# EAGLE design DAT Replacement (EAGLE 6.5.0)
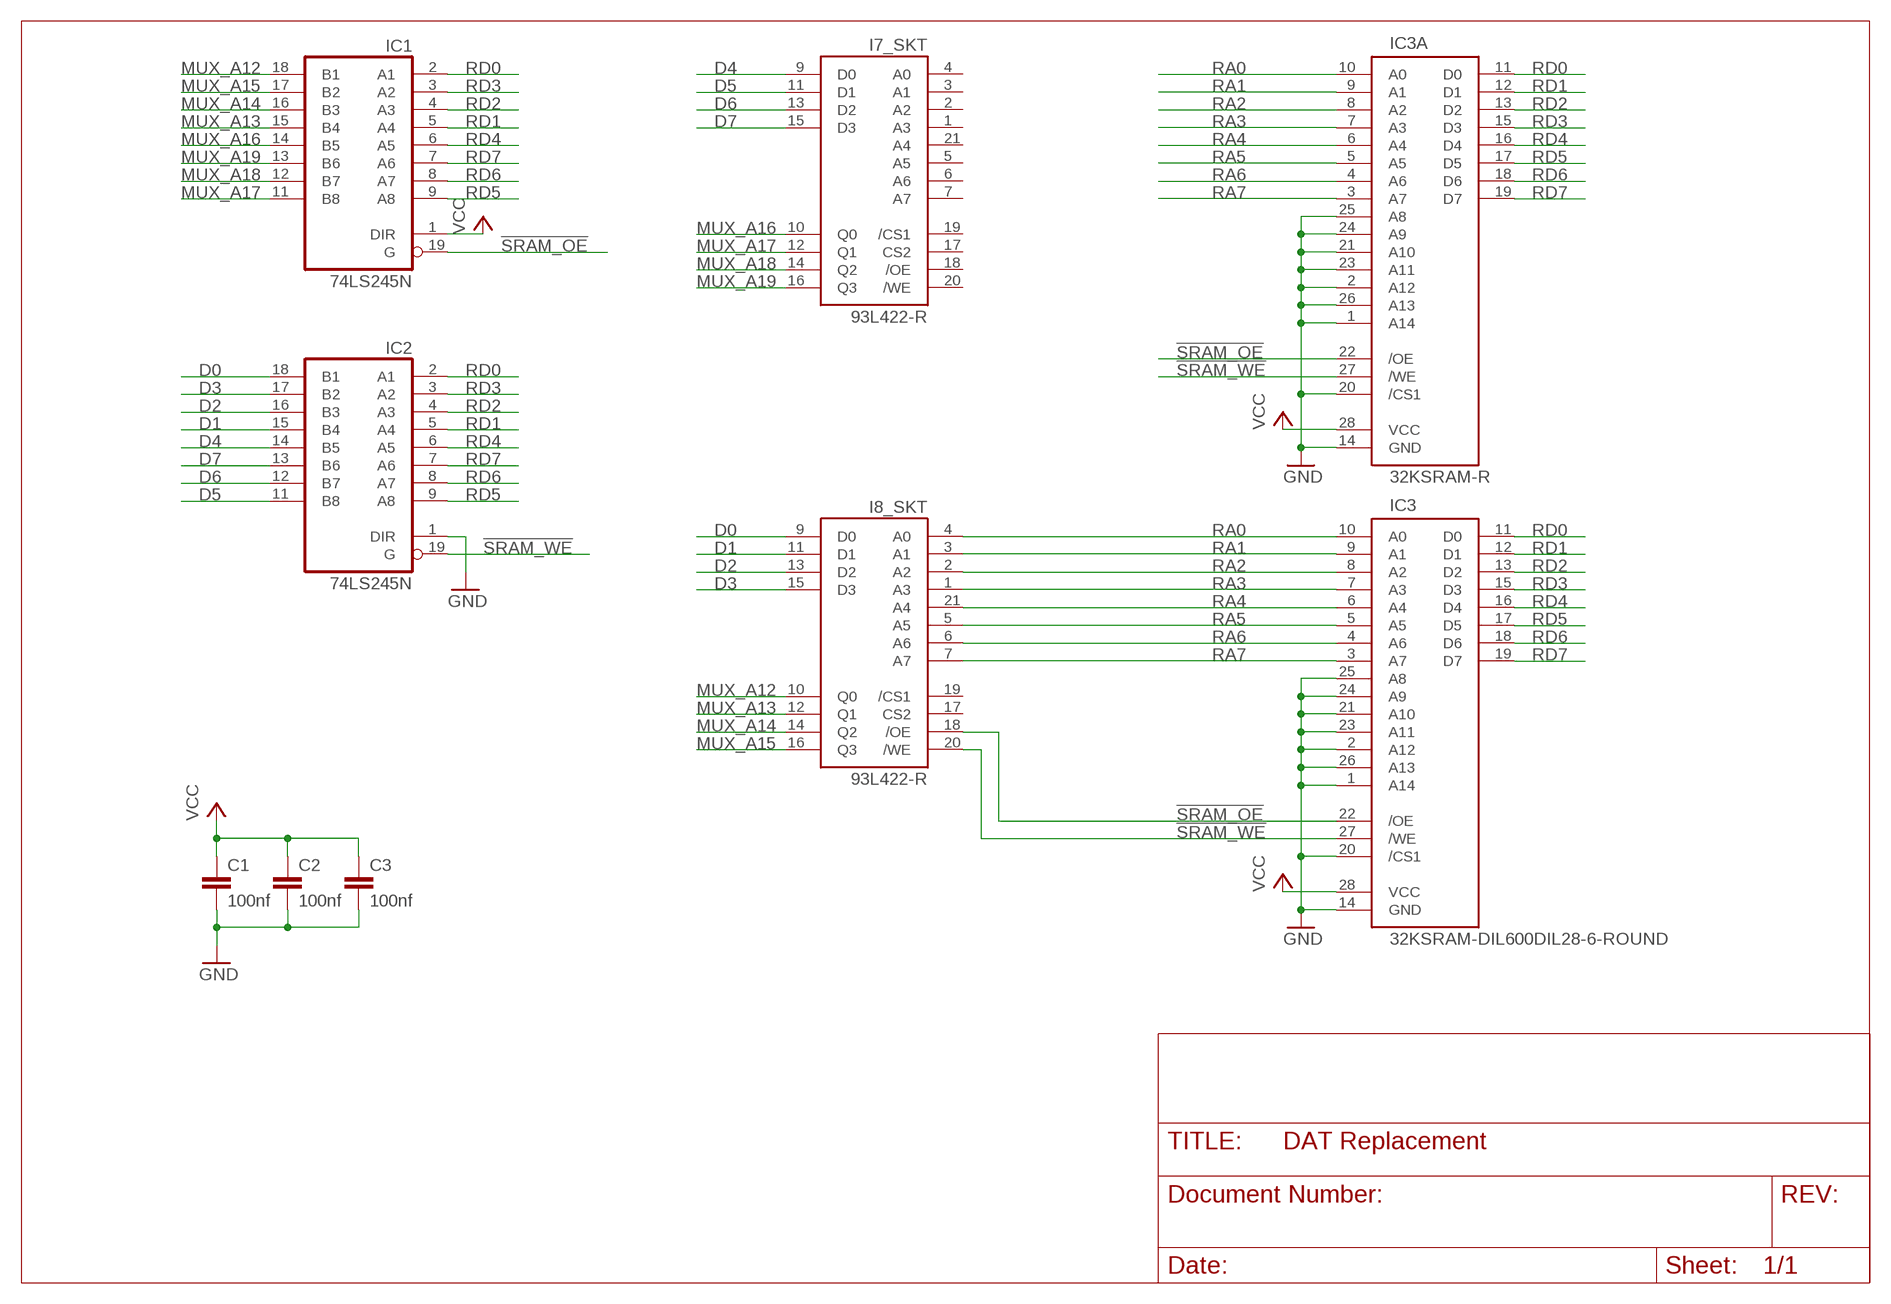
[diagram p0: schematic, sheet 1]

## Parts
C1  100nf  C-EU025-025X050  [C025-025X050]
C2  100nf  C-EU025-025X050  [C025-025X050]
C3  100nf  C-EU025-025X050  [C025-025X050]
I7_SKT  93L422-R  [DIL-22-4-ROUND]
I8_SKT  93L422-R  [DIL-22-4-ROUND]
IC1  74LS245N  [DIL20]
IC2  74LS245N  [DIL20]
IC3  32KSRAM-DIL600DIL28-6-ROUND  [DIL28-6-ROUND]
IC3A  32KSRAM-R  [DIL28-3-ROUND]

## Nets
!SRAM_OE: I8_SKT.18(/OE) IC1.19(G) IC3.22(/OE) IC3A.22(/OE)
!SRAM_WE: I8_SKT.20(/WE) IC2.19(G) IC3.27(/WE) IC3A.27(/WE)
D0: I8_SKT.9(D0) IC2.18(B1)
D1: I8_SKT.11(D1) IC2.15(B4)
D2: I8_SKT.13(D2) IC2.16(B3)
D3: I8_SKT.15(D3) IC2.17(B2)
D4: I7_SKT.9(D0) IC2.14(B5)
D5: I7_SKT.11(D1) IC2.11(B8)
D6: I7_SKT.13(D2) IC2.12(B7)
D7: I7_SKT.15(D3) IC2.13(B6)
GND: C1.2 C2.2 C3.2 IC2.1(DIR) IC3.1(A14) IC3.2(A12) IC3.14(GND) IC3.20(/CS1) IC3.21(A10) IC3.23(A11) IC3.24(A9) IC3.25(A8) IC3.26(A13) IC3A.1(A14) IC3A.2(A12) IC3A.14(GND) IC3A.20(/CS1) IC3A.21(A10) IC3A.23(A11) IC3A.24(A9) IC3A.25(A8) IC3A.26(A13)
MUX_A12: I8_SKT.10(Q0) IC1.18(B1)
MUX_A13: I8_SKT.12(Q1) IC1.15(B4)
MUX_A14: I8_SKT.14(Q2) IC1.16(B3)
MUX_A15: I8_SKT.16(Q3) IC1.17(B2)
MUX_A16: I7_SKT.10(Q0) IC1.14(B5)
MUX_A17: I7_SKT.12(Q1) IC1.11(B8)
MUX_A18: I7_SKT.14(Q2) IC1.12(B7)
MUX_A19: I7_SKT.16(Q3) IC1.13(B6)
RA0: I8_SKT.4(A0) IC3.10(A0) IC3A.10(A0)
RA1: I8_SKT.3(A1) IC3.9(A1) IC3A.9(A1)
RA2: I8_SKT.2(A2) IC3.8(A2) IC3A.8(A2)
RA3: I8_SKT.1(A3) IC3.7(A3) IC3A.7(A3)
RA4: I8_SKT.21(A4) IC3.6(A4) IC3A.6(A4)
RA5: I8_SKT.5(A5) IC3.5(A5) IC3A.5(A5)
RA6: I8_SKT.6(A6) IC3.4(A6) IC3A.4(A6)
RA7: I8_SKT.7(A7) IC3.3(A7) IC3A.3(A7)
RD0: IC1.2(A1) IC2.2(A1) IC3.11(D0) IC3A.11(D0)
RD1: IC1.5(A4) IC2.5(A4) IC3.12(D1) IC3A.12(D1)
RD2: IC1.4(A3) IC2.4(A3) IC3.13(D2) IC3A.13(D2)
RD3: IC1.3(A2) IC2.3(A2) IC3.15(D3) IC3A.15(D3)
RD4: IC1.6(A5) IC2.6(A5) IC3.16(D4) IC3A.16(D4)
RD5: IC1.9(A8) IC2.9(A8) IC3.17(D5) IC3A.17(D5)
RD6: IC1.8(A7) IC2.8(A7) IC3.18(D6) IC3A.18(D6)
RD7: IC1.7(A6) IC2.7(A6) IC3.19(D7) IC3A.19(D7)
VCC: C1.1 C2.1 C3.1 IC1.1(DIR) IC3.28(VCC) IC3A.28(VCC)
Unconnected: I7_SKT.1(A3) I7_SKT.2(A2) I7_SKT.3(A1) I7_SKT.4(A0) I7_SKT.5(A5) I7_SKT.6(A6) I7_SKT.7(A7) I7_SKT.17(CS2) I7_SKT.18(/OE) I7_SKT.19(/CS1) I7_SKT.20(/WE) I7_SKT.21(A4) I8_SKT.17(CS2) I8_SKT.19(/CS1)

## Power pins joined to a net without a drawn wire
GND: I7_SKT.8(GND) I8_SKT.8(GND) IC1.10(GND) IC2.10(GND)
VCC: I7_SKT.22(VCC) I8_SKT.22(VCC) IC1.20(VCC) IC2.20(VCC)

## Library data of the parts
C1-C3 = rcl:C-EU: CAPACITOR, European symbol
I7_SKT I8_SKT = Rom-Ram:93L422
IC1 IC2 = 74xx-eu-round:74*245: Octal BUS TRANSCEIVER, 3-state
IC3 = Rom-Ram:32KSRAM-DIL600
IC3A = Rom-Ram:32KSRAM: Standard pinout 32K x 8 bit Static RAM

## Board
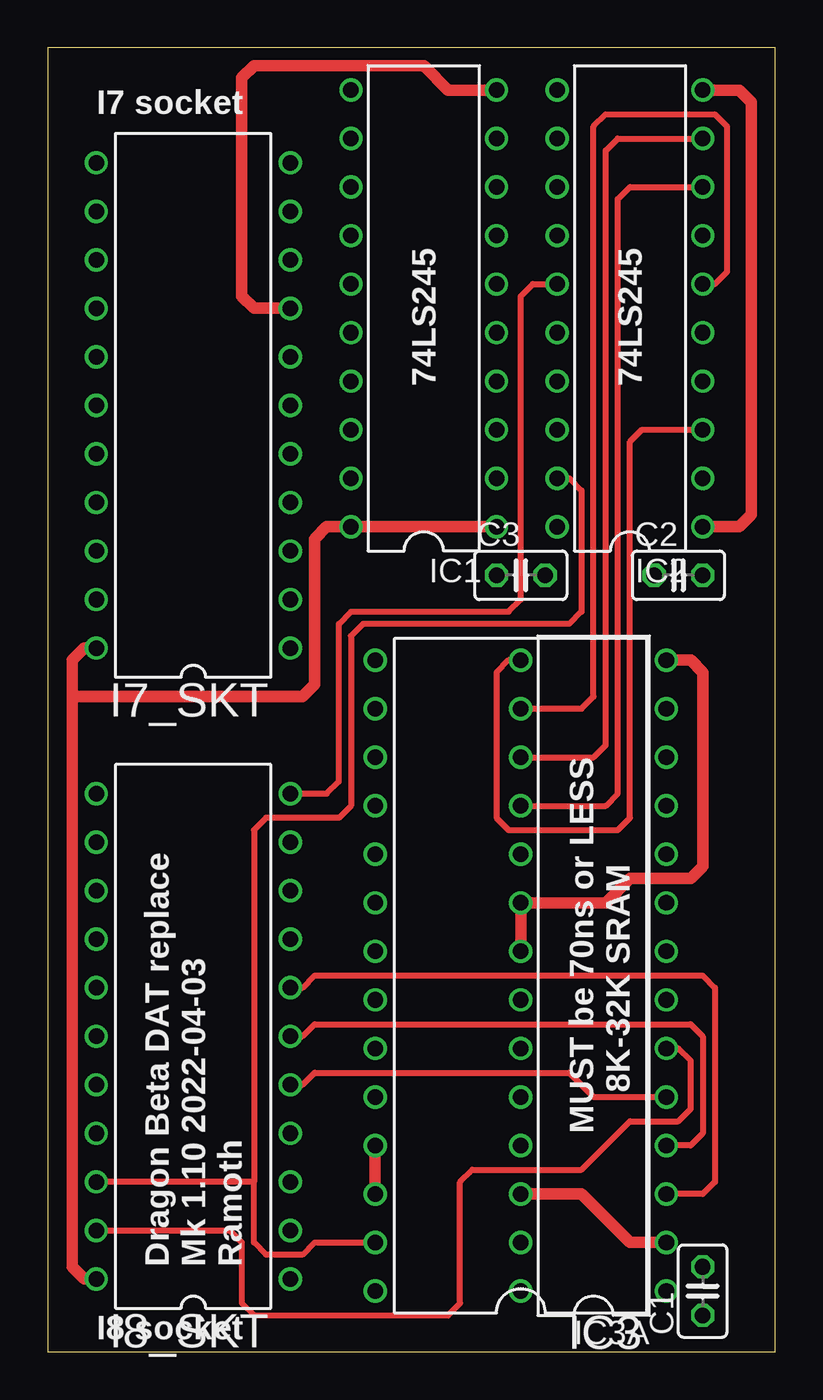
[diagram p1: board, top side]
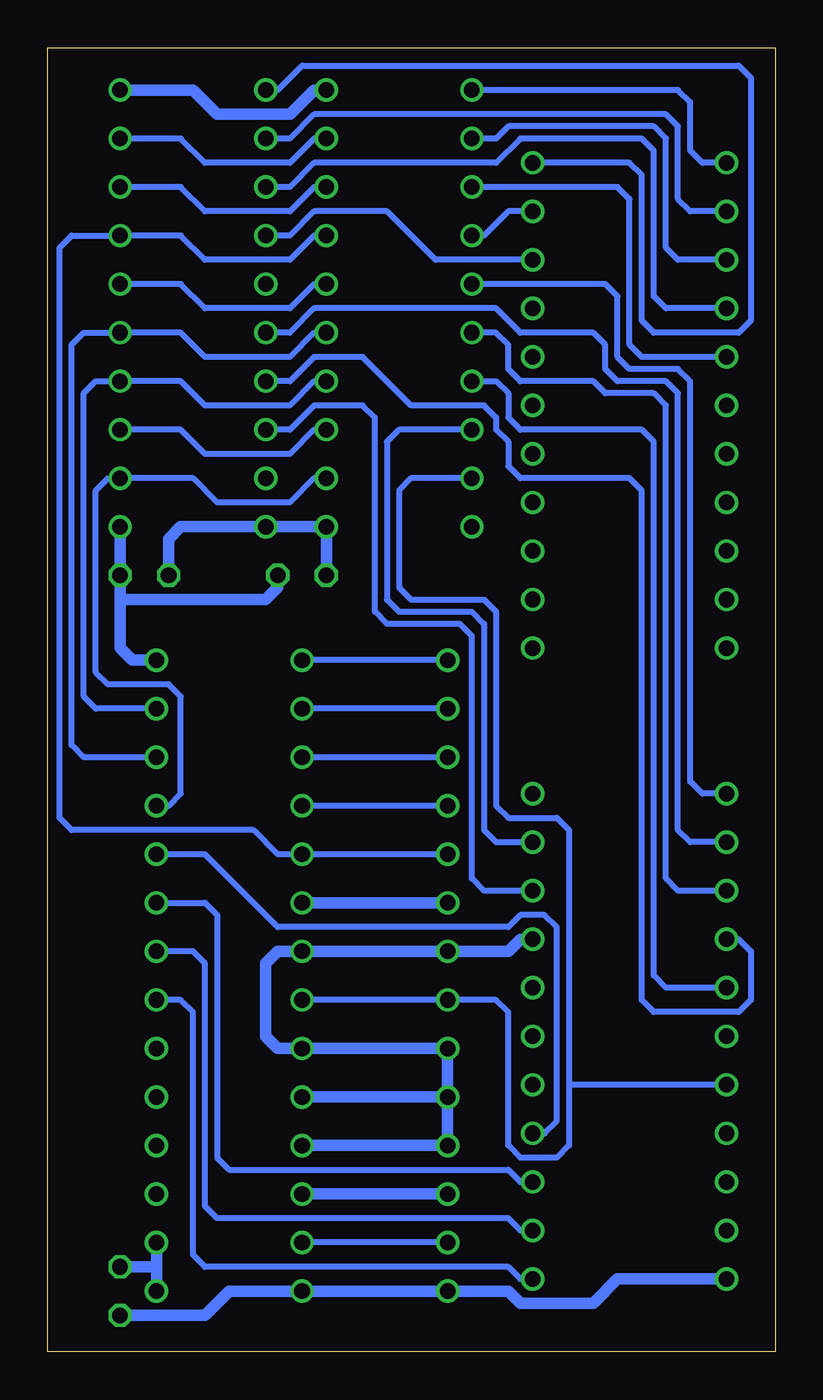
[diagram p2: board, bottom side, seen from below]

Size 38.08 x 68.25 mm. Coordinates in mm from the lower left corner, seen from the top.
Outline: 0,0 38.08,0 38.08,68.25 0,68.25 0,0
Copper layers (1*16): Top 0.035559375mm / dielectric 1.6mm / Bottom 0.035559375mm
Design rules "oshpark-2layer": minimum track width 6mil, minimum drill 10mil, track to track 6mil, track to pad 6mil, pad to pad 6mil, via to via 6mil, smd to smd 6mil, copper to edge 15mil, drill to drill 6mil, minimum pad ring 5mil, minimum via ring 5mil, stop-mask expansion 2.5mil, vias tented up to drill 0mil, thermal gap 10mil

### Footprints (pad centres in the part's own frame; a part is rotated, then mirrored left to right if it is on the bottom)
C025-025X050 = drill 0.813 octagon: 1 -1.27,0; 2 1.27,0
DIL-22-4-ROUND = drill 0.813: 1 -12.7,-5.08; 2 -10.16,-5.08; 3 -7.62,-5.08; 4 -5.08,-5.08; 5 -2.54,-5.08; 6 0,-5.08; 7 2.54,-5.08; 8 5.08,-5.08; 9 7.62,-5.08; 10 10.16,-5.08; 11 12.7,-5.08; 12 12.7,5.08; 13 10.16,5.08; 14 7.62,5.08; 15 5.08,5.08; 16 2.54,5.08; 17 0,5.08; 18 -2.54,5.08; 19 -5.08,5.08; 20 -7.62,5.08; 21 -10.16,5.08; 22 -12.7,5.08
DIL20 = drill 0.813: 1 -11.43,-3.81; 2 -8.89,-3.81; 3 -6.35,-3.81; 4 -3.81,-3.81; 5 -1.27,-3.81; 6 1.27,-3.81; 7 3.81,-3.81; 8 6.35,-3.81; 9 8.89,-3.81; 10 11.43,-3.81; 11 11.43,3.81; 12 8.89,3.81; 13 6.35,3.81; 14 3.81,3.81; 15 1.27,3.81; 16 -1.27,3.81; 17 -3.81,3.81; 18 -6.35,3.81; 19 -8.89,3.81; 20 -11.43,3.81
DIL28-6-ROUND = drill 0.813: 1 -16.51,-7.62; 2 -13.97,-7.62; 3 -11.43,-7.62; 4 -8.89,-7.62; 5 -6.35,-7.62; 6 -3.81,-7.62; 7 -1.27,-7.62; 8 1.27,-7.62; 9 3.81,-7.62; 10 6.35,-7.62; 11 8.89,-7.62; 12 11.43,-7.62; 13 13.97,-7.62; 14 16.51,-7.62; 15 16.51,7.62; 16 13.97,7.62; 17 11.43,7.62; 18 8.89,7.62; 19 6.35,7.62; 20 3.81,7.62; 21 1.27,7.62; 22 -1.27,7.62; 23 -3.81,7.62; 24 -6.35,7.62; 25 -8.89,7.62; 26 -11.43,7.62; 27 -13.97,7.62; 28 -16.51,7.62
DIL28-3-ROUND = drill 0.813: 1 -16.51,-3.81; 2 -13.97,-3.81; 3 -11.43,-3.81; 4 -8.89,-3.81; 5 -6.35,-3.81; 6 -3.81,-3.81; 7 -1.27,-3.81; 8 1.27,-3.81; 9 3.81,-3.81; 10 6.35,-3.81; 11 8.89,-3.81; 12 11.43,-3.81; 13 13.97,-3.81; 14 16.51,-3.81; 15 16.51,3.81; 16 13.97,3.81; 17 11.43,3.81; 18 8.89,3.81; 19 6.35,3.81; 20 3.81,3.81; 21 1.27,3.81; 22 -1.27,3.81; 23 -3.81,3.81; 24 -6.35,3.81; 25 -8.89,3.81; 26 -11.43,3.81; 27 -13.97,3.81; 28 -16.51,3.81

### Placement (x,y rotation side)
C1  34.29,3.17 90 top
C2  33.02,40.64 0 top
C3  24.77,40.64 0 top
I7_SKT  7.62,49.53 90 top
I8_SKT  7.62,16.51 90 top
IC1  19.68,54.61 90 top
IC2  30.48,54.61 90 top
IC3  24.77,19.68 90 top
IC3A  28.57,19.68 90 top

### Tracks (layer width: path | path; a pad name or v marks a point on that pad's centre or on a via)
!SRAM_OE
  Bottom 0.305: I8_SKT.18 10.79,13.97 | 10.79,13.97 10.79,10.79 11.43,10.16 13.34,10.16 13.97,10.79 13.97,17.78 14.61,18.41 IC3.22 IC3A.22 | IC1.19 19.05,45.72 19.68,45.09 19.68,40.01 19.05,39.37 15.24,39.37 14.61,38.73 14.61,28.57 13.97,27.94 11.43,27.94 10.79,27.3 10.79,13.97
!SRAM_WE
  Top 0.305: 10.79,8.89 10.79,5.71 11.43,5.08 13.34,5.08 13.97,5.71 IC3.27 | 10.79,8.89 I8_SKT.20 | IC2.19 27.3,45.72 27.94,45.09 27.94,38.73 27.3,38.1 16.51,38.1 15.88,37.47 15.88,28.57 15.24,27.94 11.43,27.94 10.79,27.3 10.79,8.89
  Bottom 0.305: IC3.27 IC3A.27
D0
  Bottom 0.305: I8_SKT.9 15.24,24.13 15.88,24.77 15.88,37.47 16.51,38.1 20.32,38.1 20.95,38.73 20.95,48.9 21.59,49.53 24.13,49.53 25.4,48.26 IC2.18
D1
  Top 0.305: I8_SKT.11 14.61,29.21 15.24,29.84 15.24,38.1 15.88,38.73 24.13,38.73 24.77,39.37 24.77,55.24 25.4,55.88 IC2.15
D2
  Bottom 0.305: I8_SKT.13 4.45,26.67 5.08,27.3 5.08,50.16 5.71,50.8 8.26,50.8 8.89,51.44 8.89,52.7 9.53,53.34 13.34,53.34 14.61,54.61 24.13,54.61 25.4,53.34 IC2.16
D3
  Bottom 0.305: I8_SKT.15 1.91,21.59 1.27,20.95 1.27,18.41 1.91,17.78 6.35,17.78 6.99,18.41 6.99,45.09 7.62,45.72 13.34,45.72 13.97,46.35 13.97,47.62 14.61,48.26 14.61,48.9 15.24,49.53 19.05,49.53 21.59,52.07 24.13,52.07 25.4,50.8 IC2.17
D4
  Bottom 0.305: IC2.14 25.4,58.42 24.13,59.69 20.32,59.69 17.78,57.15 I7_SKT.9
D5
  Bottom 0.305: IC2.11 26.04,66.04 24.77,67.31 1.91,67.31 1.27,66.67 1.27,53.98 1.91,53.34 6.35,53.34 6.99,53.98 6.99,61.59 7.62,62.23 I7_SKT.11
D6
  Bottom 0.305: I7_SKT.13 4.45,59.69 5.08,60.33 5.08,64.14 5.71,64.77 24.13,64.77 25.4,63.5 IC2.12
D7
  Bottom 0.305: I7_SKT.15 5.71,54.61 6.35,55.24 6.35,62.87 6.99,63.5 13.34,63.5 14.61,62.23 24.13,62.23 25.4,60.96 IC2.13
GND
  Top 0.61: IC3A.26 27.94,8.26 30.48,5.71 IC3.2 | IC3.26 IC3.25 | IC1.10 20.95,66.04 19.68,67.31 10.79,67.31 10.16,66.67 10.16,55.24 10.79,54.61 I7_SKT.8 | IC3A.21 IC3A.20 29.21,23.5 30.48,24.77 33.66,24.77 34.29,25.4 34.29,35.56 33.66,36.2 IC3.14 | IC2.10 36.2,66.04 36.83,65.41 36.83,43.81 36.2,43.18 IC2.1
  Bottom 0.61: IC3.2 32.38,4.45 | 32.38,4.45 IC3.1 | IC3.26 IC3A.26 | IC3.24 IC3.25 IC3A.25 | IC3.24 IC3.23 IC3A.23 26.04,15.88 26.67,16.51 26.67,20.32 26.04,20.95 IC3A.21 IC3.21 13.97,20.95 13.34,21.59 I8_SKT.8 | IC3A.24 IC3.24 | IC1.10 24.13,66.04 25.4,64.77 29.21,64.77 30.48,66.04 IC2.10 | IC3.20 IC3A.20 | C1.2 32.38,4.45 | IC2.1 C2.2 34.29,39.37 | 34.29,39.37 34.29,36.83 33.66,36.2 IC3.14 | C3.2 26.04,40.01 26.67,39.37 34.29,39.37
MUX_A12
  Bottom 0.305: I8_SKT.10 14.61,26.67 15.24,27.3 15.24,38.1 15.88,38.73 19.68,38.73 20.32,39.37 20.32,47.62 19.68,48.26 IC1.18
MUX_A13
  Bottom 0.305: I8_SKT.12 3.81,29.21 4.45,29.84 4.45,50.8 5.08,51.44 7.62,51.44 8.26,52.07 8.26,55.24 8.89,55.88 IC1.15
MUX_A14
  Bottom 0.305: I8_SKT.14 5.08,24.13 5.71,24.77 5.71,49.53 6.35,50.16 8.89,50.16 9.53,50.8 13.34,50.8 13.97,51.44 13.97,52.7 14.61,53.34 IC1.16
MUX_A15
  Bottom 0.305: I8_SKT.16 5.71,19.05 6.35,19.68 6.35,47.62 6.99,48.26 13.34,48.26 13.97,48.9 13.97,50.16 14.61,50.8 IC1.17
MUX_A16
  Bottom 0.305: I7_SKT.10 13.97,59.69 15.24,58.42 IC1.14
MUX_A17
  Bottom 0.305: I7_SKT.12 3.81,62.23 4.45,62.87 4.45,65.41 5.08,66.04 IC1.11
MUX_A18
  Bottom 0.305: I7_SKT.14 5.08,57.15 5.71,57.78 5.71,63.5 6.35,64.14 13.97,64.14 14.61,63.5 IC1.12
MUX_A19
  Bottom 0.305: I7_SKT.16 6.99,52.07 7.62,52.7 7.62,60.33 8.26,60.96 IC1.13
RA0
  Bottom 0.305: I8_SKT.4 12.06,11.43 11.43,12.06 11.43,22.23 12.06,22.86 13.34,22.86 13.97,22.23 26.04,22.23 29.84,26.04 IC3.10
RA1
  Bottom 0.305: IC3.9 29.84,23.5 29.21,22.86 29.21,10.16 28.57,9.53 13.97,9.53 13.34,8.89 I8_SKT.3
RA2
  Bottom 0.305: I8_SKT.2 13.34,6.35 13.97,6.99 29.21,6.99 29.84,7.62 29.84,20.32 30.48,20.95 IC3.8
RA3
  Bottom 0.305: I8_SKT.1 13.34,3.81 13.97,4.45 29.84,4.45 30.48,5.08 30.48,17.78 31.11,18.41 IC3.7
RA4
  Top 0.305: I8_SKT.21 9.53,6.35 10.16,5.71 10.16,2.54 10.79,1.91 20.95,1.91 21.59,2.54 21.59,8.89 22.23,9.53 27.94,9.53 30.48,12.06 33.02,12.06 33.66,12.7 33.66,15.24 33.02,15.88 IC3.6
RA5
  Top 0.305: I8_SKT.5 13.34,13.97 13.97,14.61 27.3,14.61 28.57,13.34 IC3.5
RA6
  Top 0.305: I8_SKT.6 13.34,16.51 13.97,17.14 33.66,17.14 34.29,16.51 34.29,11.43 33.66,10.79 IC3.4
RA7
  Top 0.305: I8_SKT.7 13.34,19.05 13.97,19.68 34.29,19.68 34.92,19.05 34.92,8.89 34.29,8.26 IC3.3
RD0
  Bottom 0.305: IC1.2 24.13,45.72 25.4,44.45 29.21,44.45 30.48,45.72 IC2.2 34.92,45.72 35.56,45.09 35.56,35.56 34.92,34.92 31.75,34.92 31.11,34.29 31.11,29.21 31.75,28.57 IC3.11
RD1
  Bottom 0.305: IC1.5 24.13,53.34 25.4,52.07 29.84,52.07 31.11,53.34 IC2.5 36.2,53.34 36.83,52.7 36.83,31.75 36.2,31.11 IC3.12
RD2
  Bottom 0.305: IC1.4 24.13,50.8 25.4,49.53 29.84,49.53 31.11,50.8 IC2.4 35.56,50.8 36.2,50.16 36.2,34.29 35.56,33.66 IC3.13
RD3
  Top 0.305: IC3A.15 24.13,36.2 23.5,35.56 23.5,27.94 24.13,27.3 29.84,27.3 30.48,27.94 30.48,47.62 31.11,48.26 IC2.3
  Bottom 0.305: IC1.3 24.13,48.26 25.4,46.99 29.84,46.99 31.11,48.26 IC2.3 | IC3.15 IC3A.15
RD4
  Top 0.305: IC3A.16 27.94,33.66 28.57,34.29 28.57,64.14 29.21,64.77 34.92,64.77 35.56,64.14 35.56,56.52 34.92,55.88 IC2.6
  Bottom 0.305: IC2.6 31.11,55.88 29.84,54.61 25.4,54.61 24.13,55.88 IC1.6 | IC3.16 IC3A.16
RD5
  Top 0.305: IC3A.17 28.57,31.11 29.21,31.75 29.21,62.87 29.84,63.5 IC2.9
  Bottom 0.305: IC1.9 24.13,63.5 25.4,62.23 29.84,62.23 31.11,63.5 IC2.9 | IC3.17 IC3A.17
RD6
  Top 0.305: IC3A.18 29.21,28.57 29.84,29.21 29.84,60.33 30.48,60.96 IC2.8
  Bottom 0.305: IC1.8 24.13,60.96 25.4,59.69 29.84,59.69 31.11,60.96 IC2.8 | IC3.18 IC3A.18
RD7
  Bottom 0.305: IC1.7 24.13,58.42 25.4,57.15 29.84,57.15 31.11,58.42 IC2.7 36.83,58.42 37.47,57.78 37.47,27.94 36.83,27.3 27.3,27.3 26.04,26.04 IC3A.19 IC3.19
VCC
  Top 0.61: IC1.1 IC1.20 14.61,43.18 13.97,42.55 13.97,34.92 13.34,34.29 1.27,34.29 | I8_SKT.22 1.91,3.81 1.27,4.45 1.27,34.29 | 1.27,34.29 1.27,36.2 1.91,36.83 I7_SKT.22
  Bottom 0.61: I8_SKT.22 8.26,3.81 9.53,2.54 13.34,2.54 13.97,3.17 IC3.28 IC3A.28 28.57,3.17 29.84,1.91 C1.1 | C2.1 31.75,42.55 31.11,43.18 IC2.20 IC1.1 C3.1

### Text on the board
tPlace: I7 socket | 74LS245 | 74LS245 | MUST be 70ns or LESS | 8K-32K SRAM | Dragon Beta DAT replace / Mk 1.10 2022-04-03 / Ramoth | I8 socket